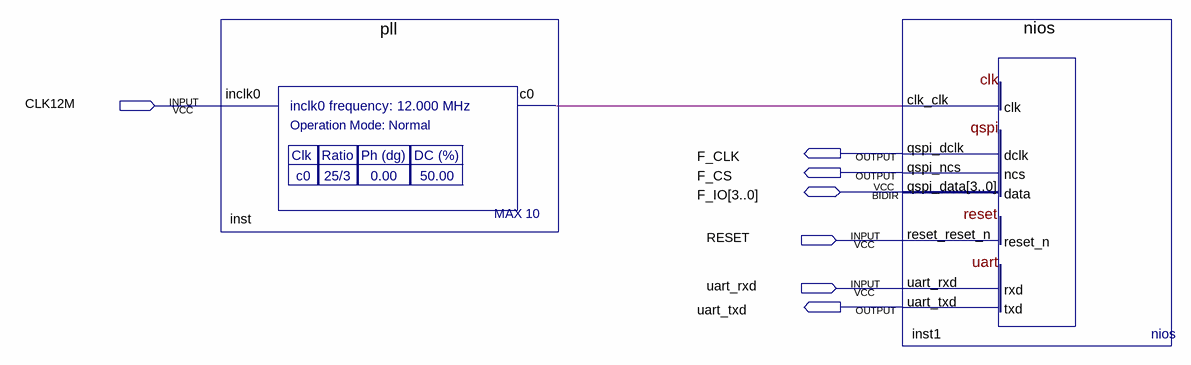
[diagram p0: schematic sheet]
// Quartus schematic nios_top.bdf as structural Verilog: 2 symbols, 7 pins
module nios_top (
  input  CLK12M,
  input  RESET,
  input  uart_rxd,
  inout  [3:0] F_IO,
  output F_CLK,
  output F_CS,
  output uart_txd
);

  wire inst_c0;

  pll inst (.inclk0(CLK12M), .c0(inst_c0));
  nios inst1 (
    .clk_clk(inst_c0), .reset_reset_n(RESET), .uart_rxd(uart_rxd), .qspi_dclk(F_CLK), .qspi_ncs(F_CS),
    .uart_txd(uart_txd), .qspi_data(F_IO));
endmodule
